# Altium schematic sheet POWER.SchDoc (part 1 of 3)
size A3; SheetNumber: 2; SheetTotal: 9
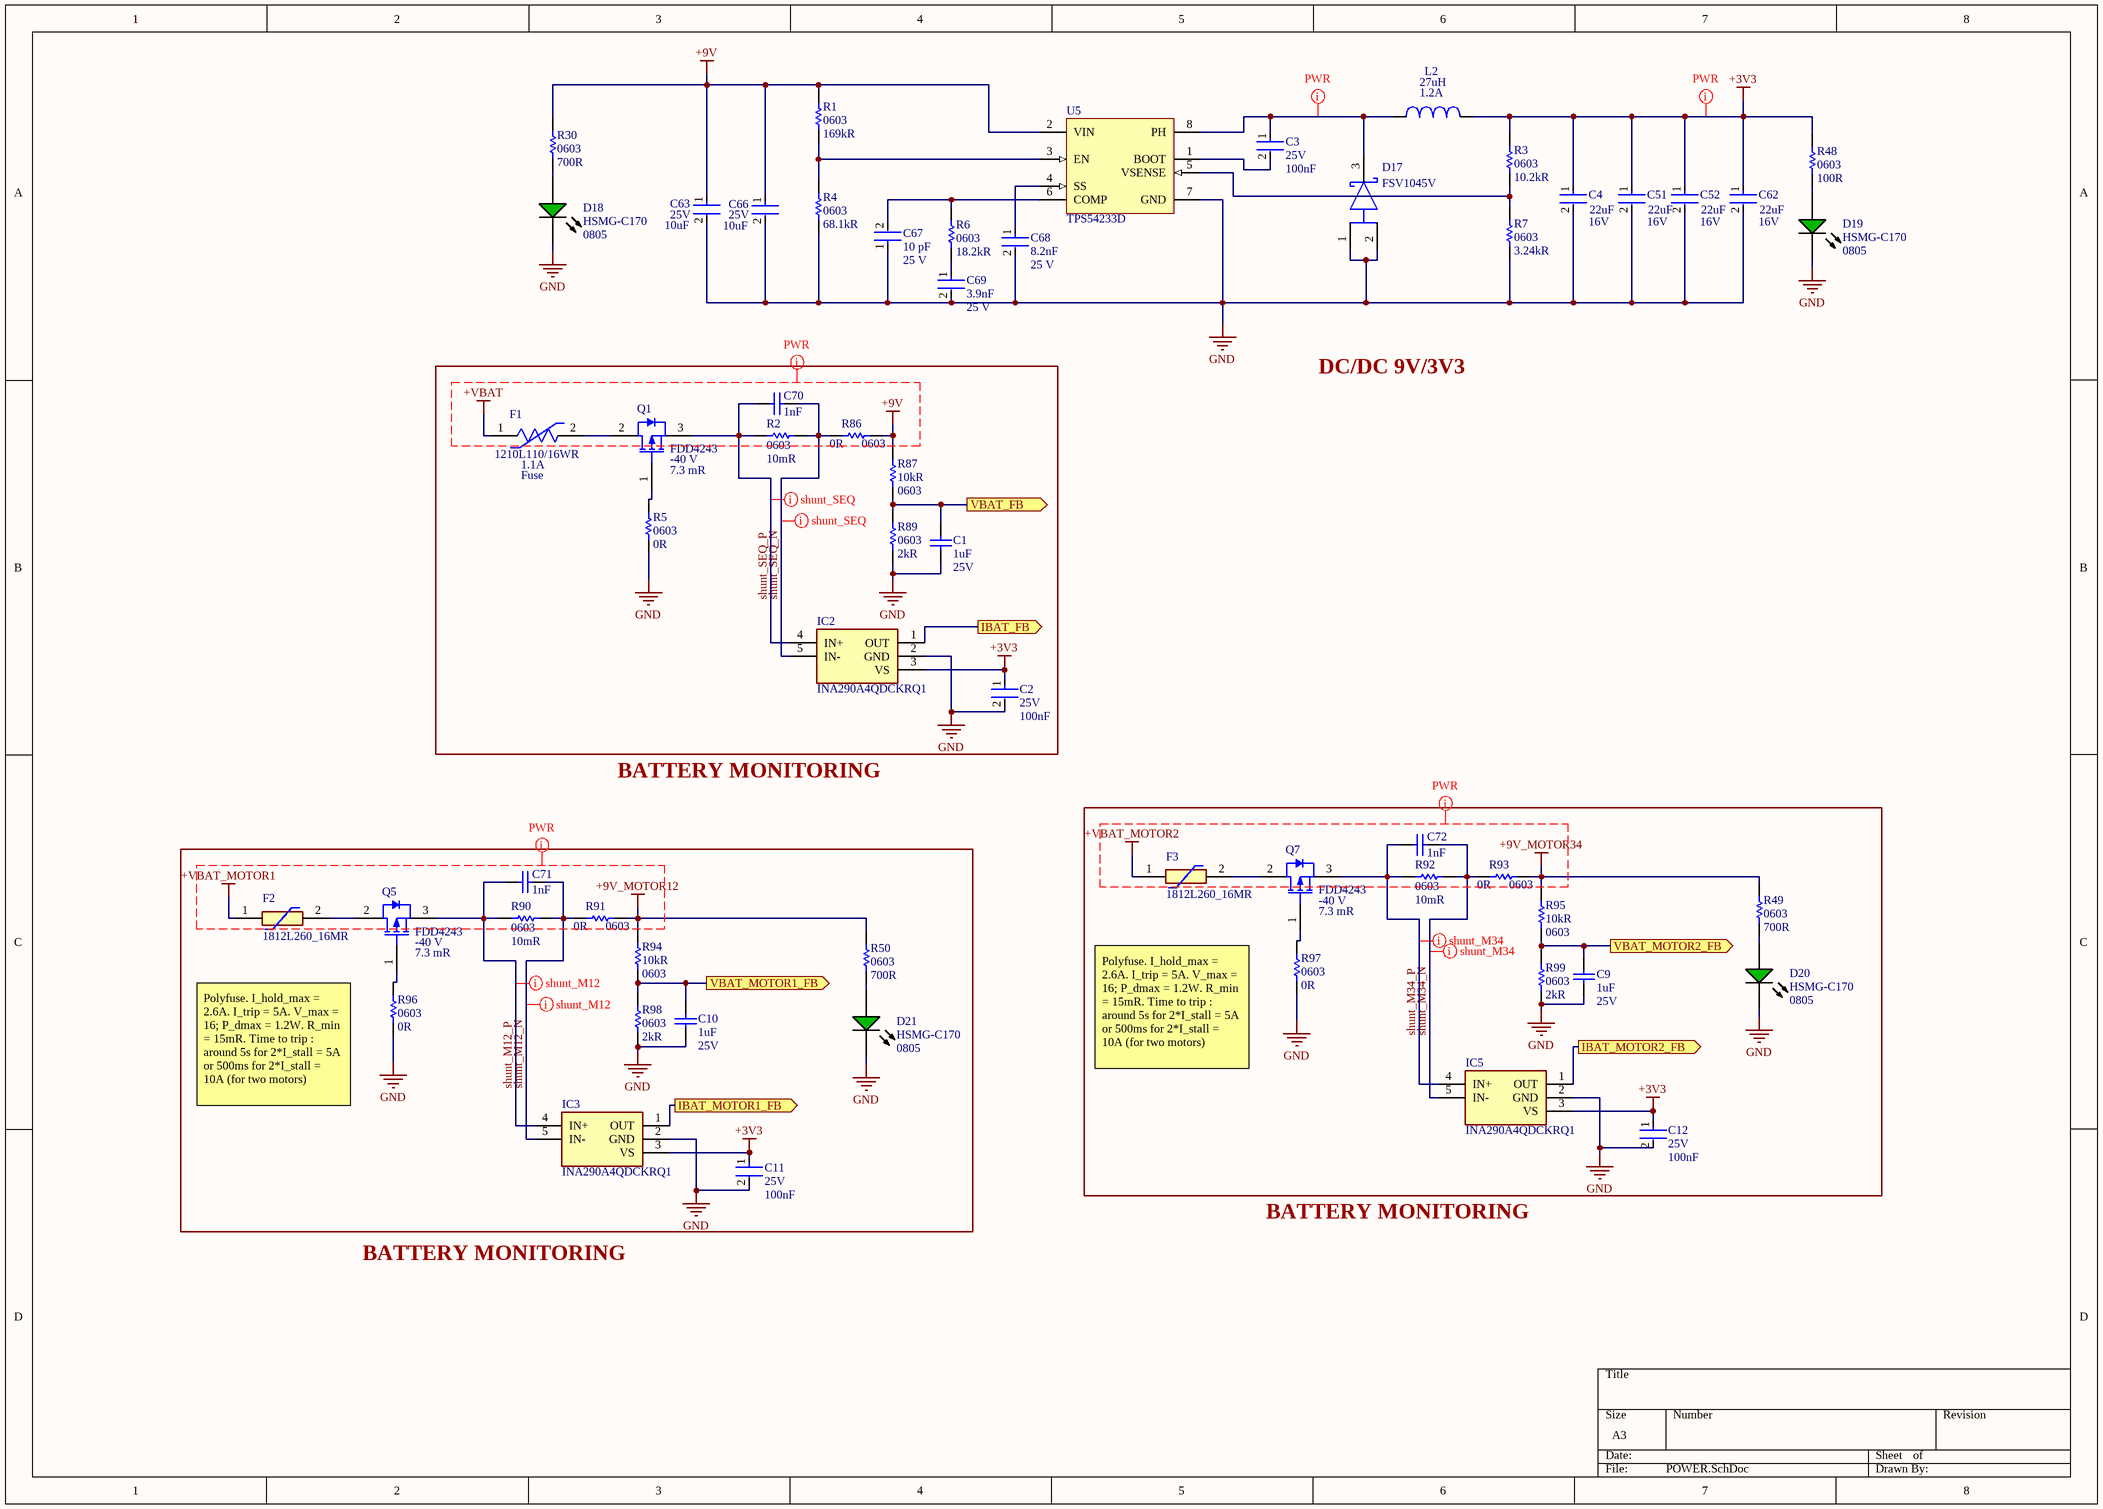
[diagram p0: POWER.SchDoc]

## Parts
C1  Capacitance: 1uF  Voltage Rating (DC): 25V  [CAPC1608X90X35LL15T15]  (hidden comment: C0603C105K3PAC7867)
C2  Voltage Rating (DC): 25V  Capacitance: 100nF  [FP-CGA3E-0_3-0_1-MFG]  (hidden comment: CGA3E2X7R1E104K080AA)
C3  Voltage Rating (DC): 25V  Capacitance: 100nF  [FP-CGA3E-0_3-0_1-MFG]  (hidden comment: CGA3E2X7R1E104K080AA)
C4  value 22uF  Voltage: 16V  [FP-C2012-125-MFG]  (hidden comment: C2012X5R1C226K125AC)
C9  Capacitance: 1uF  Voltage Rating (DC): 25V  [CAPC1608X90X35LL15T15]  (hidden comment: C0603C105K3PAC7867)
C10  Capacitance: 1uF  Voltage Rating (DC): 25V  [CAPC1608X90X35LL15T15]  (hidden comment: C0603C105K3PAC7867)
C11  Voltage Rating (DC): 25V  Capacitance: 100nF  [FP-CGA3E-0_3-0_1-MFG]  (hidden comment: CGA3E2X7R1E104K080AA)
C12  Voltage Rating (DC): 25V  Capacitance: 100nF  [FP-CGA3E-0_3-0_1-MFG]  (hidden comment: CGA3E2X7R1E104K080AA)
C51  value 22uF  Voltage: 16V  [FP-C2012-125-MFG]  (hidden comment: C2012X5R1C226K125AC)
C52  value 22uF  Voltage: 16V  [FP-C2012-125-MFG]  (hidden comment: C2012X5R1C226K125AC)
C62  value 22uF  Voltage: 16V  [FP-C2012-125-MFG]  (hidden comment: C2012X5R1C226K125AC)
C63  Voltage Rating (DC): 25V  Capacitance: 10uF  [FP-C2012-125-0_2-IPC_B]  (hidden comment: C2012X5R1E106K125AB)
C66  Voltage Rating (DC): 25V  Capacitance: 10uF  [FP-C2012-125-0_2-IPC_B]  (hidden comment: C2012X5R1E106K125AB)
C67  Capacitance: 10 pF  Voltage Rating: 25 V  [FP-C0603C-CF-MFG]  (hidden comment: C0603C100J3GACTU)
C68  value 8.2nF  Voltage Rating: 25 V  [FP-C0603C-CF-MFG]  (hidden comment: C0603C822K3RACTU)
C69  Capacitance: 3.9nF  Voltage Rating: 25 V  [FP-C0603C-CF-MFG]  (hidden comment: C0603C392K3RACTU)
C70  1nF  [SAMS-C0603-2_M]
C71  1nF  [SAMS-C0603-2_M]
C72  1nF  [SAMS-C0603-2_M]
D17  FSV1045V  [FP-340BQ-MFG]
D18  HSMG-C170  Case/Package: 0805  [AVAG-HSMX-C170_V]
D19  HSMG-C170  Case/Package: 0805  [AVAG-HSMX-C170_V]
D20  HSMG-C170  Case/Package: 0805  [AVAG-HSMX-C170_V]
D21  HSMG-C170  Case/Package: 0805  [AVAG-HSMX-C170_V]
F1  1210L110/16WR  Hold Current: 1.1A  Category: Fuse  [FP-1210L110-16WR-MFG]
F2  1812L260_16MR  [1812L010DR]
F3  1812L260_16MR  [1812L010DR]
IC2  INA290A4QDCKRQ1  [SOT65P210X110-5N]
IC3  INA290A4QDCKRQ1  [SOT65P210X110-5N]
IC5  INA290A4QDCKRQ1  [SOT65P210X110-5N]
L2  Inductance: 27uH  Max DC Current: 1.2A  [SRR6038]  (hidden comment: SRR6038-270Y)
Q1  FDD4243  VDS (max): -40 V  RDS (on) (max) (@10V): 7.3 mR  [INF-PG-TO252-3-313_L]
Q5  FDD4243  VDS (max): -40 V  RDS (on) (max) (@10V): 7.3 mR  [INF-PG-TO252-3-313_L]
Q7  FDD4243  VDS (max): -40 V  RDS (on) (max) (@10V): 7.3 mR  [INF-PG-TO252-3-313_L]
R1  Case Code (Imperial): 0603  Resistance: 169kR  [RESC1608X55X30ML15T15]  (hidden comment: ERJ-3EKF1693V)
R2  Case Code (Imperial): 0603  Resistance: 10mR  [RESC1508X46X38ML25T25]  (hidden comment: WSL0603R0100FEA)
R3  Case Code (Imperial): 0603  Resistance: 10.2kR  [RESC1608X55X30LL15T15]  (hidden comment: ERJ-3EKF1022V)
R4  Case Code (Imperial): 0603  Resistance: 68.1kR  [RESC1608X55X30ML15T15]  (hidden comment: ERJ-3EKF6812V)
R5  Case Code (Imperial): 0603  Resistance: 0R  [RESC1608X55X25ML10T15]  (hidden comment: RC0603JR-070RL)
R6  Case Code (Imperial): 0603  Resistance: 18.2kR  [RESC1608X55X30NL15T15]  (hidden comment: ERJ-3EKF1822V)
R7  Case Code (Imperial): 0603  Resistance: 3.24kR  [RESC1608X55X30ML15T15]  (hidden comment: ERJ-3EKF3241V)
R30  Case Code (Imperial): 0603  Resistance: 700R  [RESC1609X50X30NL10T20]  (hidden comment: CRCW060390R9FKEA)
R48  Case Code (Imperial): 0603  Resistance: 100R  [RESC1609X50X30NL10T20]  (hidden comment: CRCW060390R9FKEA)
R49  Case Code (Imperial): 0603  Resistance: 700R  [RESC1609X50X30NL10T20]  (hidden comment: CRCW060390R9FKEA)
R50  Case Code (Imperial): 0603  Resistance: 700R  [RESC1609X50X30NL10T20]  (hidden comment: CRCW060390R9FKEA)
R86  Case Code (Imperial): 0603  Resistance: 0R  [RESC1608X55X25ML10T15]  (hidden comment: RC0603JR-070RL)
R87  Resistance: 10kR  Case Code (Imperial): 0603  [RESC1609X55X30LL15T15]  (hidden comment: ERJ3EKF1002V)
R89  Case Code (Imperial): 0603  Resistance: 2kR  [RESC1608X55X30ML15T15]  (hidden comment: ERJ-3EKF2001V)
R90  Case Code (Imperial): 0603  Resistance: 10mR  [RESC1508X46X38ML25T25]  (hidden comment: WSL0603R0100FEA)
R91  Case Code (Imperial): 0603  Resistance: 0R  [RESC1608X55X25ML10T15]  (hidden comment: RC0603JR-070RL)
R92  Case Code (Imperial): 0603  Resistance: 10mR  [RESC1508X46X38ML25T25]  (hidden comment: WSL0603R0100FEA)
R93  Case Code (Imperial): 0603  Resistance: 0R  [RESC1608X55X25ML10T15]  (hidden comment: RC0603JR-070RL)
R94  Resistance: 10kR  Case Code (Imperial): 0603  [RESC1609X55X30LL15T15]  (hidden comment: ERJ3EKF1002V)
R95  Resistance: 10kR  Case Code (Imperial): 0603  [RESC1609X55X30LL15T15]  (hidden comment: ERJ3EKF1002V)
R96  Case Code (Imperial): 0603  Resistance: 0R  [RESC1608X55X25ML10T15]  (hidden comment: RC0603JR-070RL)
R97  Case Code (Imperial): 0603  Resistance: 0R  [RESC1608X55X25ML10T15]  (hidden comment: RC0603JR-070RL)
R98  Case Code (Imperial): 0603  Resistance: 2kR  [RESC1608X55X30ML15T15]  (hidden comment: ERJ-3EKF2001V)
R99  Case Code (Imperial): 0603  Resistance: 2kR  [RESC1608X55X30ML15T15]  (hidden comment: ERJ-3EKF2001V)
U5  TPS54233D  [D0008A_M]

## Ports
IBAT_FB (out), IBAT_MOTOR1_FB (out), IBAT_MOTOR2_FB (out), VBAT_FB (out), VBAT_MOTOR1_FB (out), VBAT_MOTOR2_FB (out)

## Nets
+3V3: C2.1 C4.1 C11.1 C12.1 C51.1 C52.1 C62.1 IC2.3(VS) IC3.3(VS) IC5.3(VS) L2.2 R3.2 R48.2
+9V: C63.1 C66.1 R1.2 R30.2 R86.2 R87.2 U5.2(VIN)
+9V_MOTOR12: R50.2 R91.2 R94.2
+9V_MOTOR34: R49.2 R93.2 R95.2
+VBAT: F1.1
+VBAT_MOTOR1: F2.1
+VBAT_MOTOR2: F3.1
GND: C1.1 C2.2 C4.2 C9.1 C10.1 C11.2 C12.2 C51.2 C52.2 C62.2 C63.2 C66.2 C67.1 C68.2 C69.2 D17.1(A) D17.2(A) D18.2(K) D19.2(K) D20.2(K) D21.2(K) IC2.2(GND) IC3.2(GND) IC5.2(GND) R4.1 R5.1 R7.1 R89.1 R96.1 R97.1 R98.1 R99.1 U5.7(GND)
IBAT_FB: IC2.1(OUT) ; port IBAT_FB
IBAT_MOTOR1_FB: IC3.1(OUT) ; port IBAT_MOTOR1_FB
IBAT_MOTOR2_FB: IC5.1(OUT) ; port IBAT_MOTOR2_FB
shunt_M12_N: C71.1 IC3.5(IN-) R90.2 R91.1
shunt_M12_P: C71.2 IC3.4(IN+) Q5.3(SOURCE) R90.1
shunt_M34_N: C72.1 IC5.5(IN-) R92.2 R93.1
shunt_M34_P: C72.2 IC5.4(IN+) Q7.3(SOURCE) R92.1
shunt_SEQ_N: C70.1 IC2.5(IN-) R2.2 R86.1
shunt_SEQ_P: C70.2 IC2.4(IN+) Q1.3(SOURCE) R2.1
VBAT_FB: C1.2 R87.1 R89.2 ; port VBAT_FB
VBAT_MOTOR1_FB: C10.2 R94.1 R98.2 ; port VBAT_MOTOR1_FB
VBAT_MOTOR2_FB: C9.2 R95.1 R99.2 ; port VBAT_MOTOR2_FB
NetC3_1: C3.1 D17.3(C) L2.1 U5.8(PH)
NetC3_2: C3.2 U5.1(BOOT)
NetC67_2: C67.2 R6.2 U5.6(COMP)
NetC68_1: C68.1 U5.4(SS)
NetC69_1: C69.1 R6.1
NetD18_1: D18.1(A) R30.1
NetD19_1: D19.1(A) R48.1
NetD20_1: D20.1(A) R49.1
NetD21_1: D21.1(A) R50.1
NetF1_2: F1.2 Q1.2(DRAIN)
NetF2_2: F2.2 Q5.2(DRAIN)
NetF3_2: F3.2 Q7.2(DRAIN)
NetQ1_1: Q1.1(GATE) R5.2
NetQ5_1: Q5.1(GATE) R96.2
NetQ7_1: Q7.1(GATE) R97.2
NetR1_1: R1.1 R4.2 U5.3(EN)
NetR3_1: R3.1 R7.2 U5.5(VSENSE)

## Layout directives
net class PWR: +3V3, +9V, +9V_MOTOR12, +9V_MOTOR34, +VBAT, +VBAT_MOTOR1, +VBAT_MOTOR2, NetC3_1
differential pair; differential pair class shunt_M12: shunt_M12_N, shunt_M12_P
differential pair; differential pair class shunt_SEQ: shunt_SEQ_N, shunt_SEQ_P
differential pair; differential pair class shunt_M34: shunt_M34_N, shunt_M34_P

## Notes on the sheet
- DC/DC 9V/3V3
- BATTERY MONITORING
- Polyfuse. I_hold_max = 2.6A. I_trip = 5A. V_max = 16; P_dmax = 1.2W. R_min = 15mR. Time to trip : around 5s for 2*I_stall = 5A or 500ms for 2*I_stall = 10A (for two motors)